# EAGLE design Transceiver (EAGLE 9.4.2)
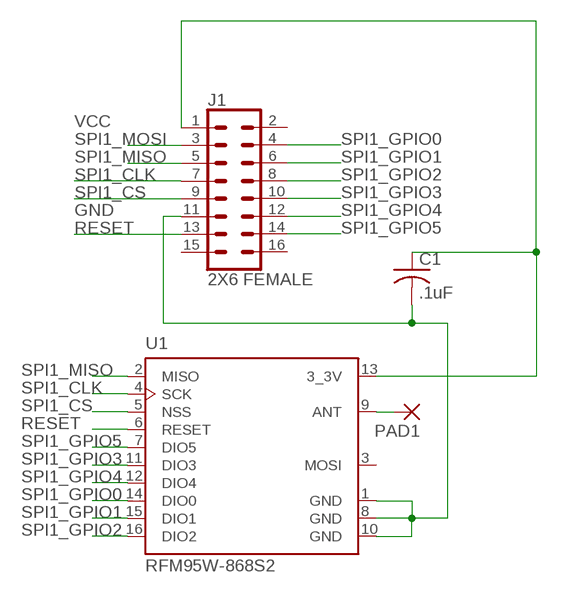
[diagram p0: schematic, sheet 1]

## Parts
C1  .1uF  C-ALL_PACKAGESC1206  [C1206]
J1  2X6 FEMALE  SENSOR_BREAKOUTPTH_FEMALE  [2X7]
PAD1  2,54/1,0  [2,54/1,0]
U1  RFM95W-868S2  [XCVR_RFM95W-868S2]

## Nets
GND: C1.2 J1.11 U1.1(GND) U1.8(GND) U1.10(GND)
N$12: PAD1.1(P) U1.9(ANT)
RESET: J1.13 U1.6(RESET)
SPI1_CLK: J1.7 U1.4(SCK)
SPI1_CS: J1.9 U1.5(NSS)
SPI1_GPIO0: J1.4 U1.14(DIO0)
SPI1_GPIO1: J1.6 U1.15(DIO1)
SPI1_GPIO2: J1.8 U1.16(DIO2)
SPI1_GPIO3: J1.10 U1.11(DIO3)
SPI1_GPIO4: J1.12 U1.12(DIO4)
SPI1_GPIO5: J1.14 U1.7(DIO5)
SPI1_MISO: J1.5 U1.2(MISO)
SPI1_MOSI: J1.3
VCC: C1.1 J1.1 U1.13(3_3V)
Unconnected: J1.2 J1.15 J1.16 U1.3(MOSI)

## Library data of the parts
C1 = RTR:C-ALL_PACKAGES: CAPACITOR, American symbol
J1 = RTR:SENSOR_BREAKOUT: .1 inch-spaced 12P sensor breakout Used as a generalized connector for attaching new sensors; PROD_ID: CONN-12423
PAD1 = wirepad:2,54/1,0: THROUGH-HOLE PAD
U1 = RFM95W-868S2:RFM95W-868S2: Mod Txrx Lora +20dbm 868mhz Smd; AVAILABILITY: Unavailable; MF: RF; MP: RFM95W-868S2; PACKAGE: SMD-16 Hope Microelectronics; PRICE: None

## Board
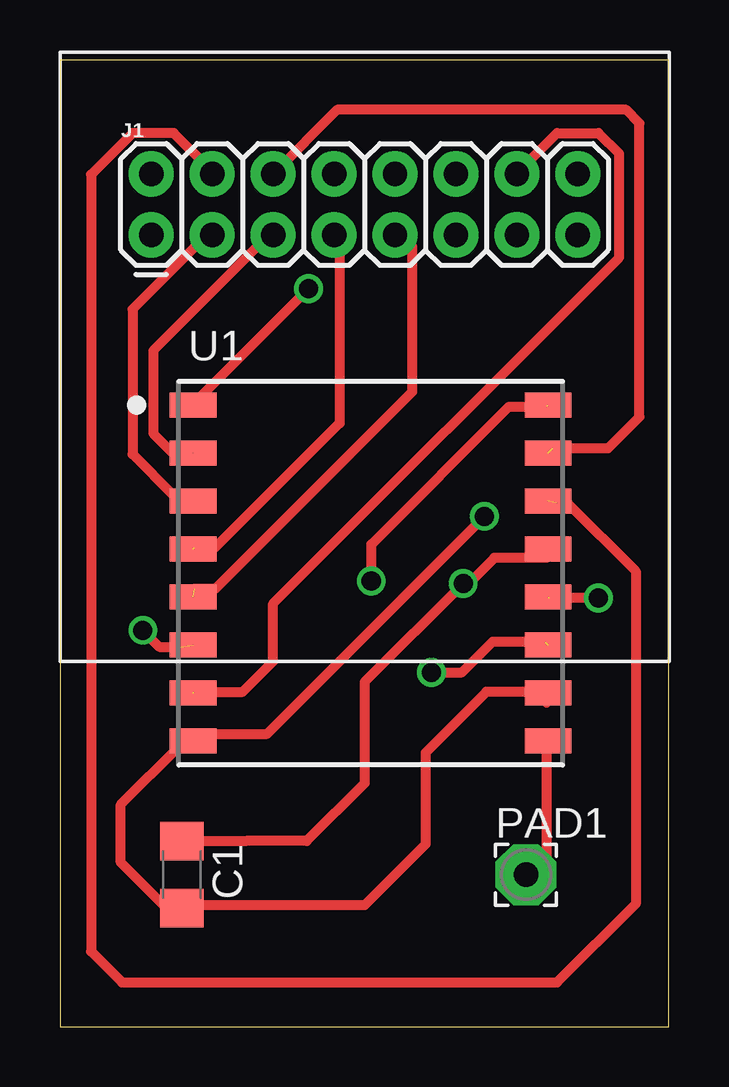
[diagram p1: board, top side]
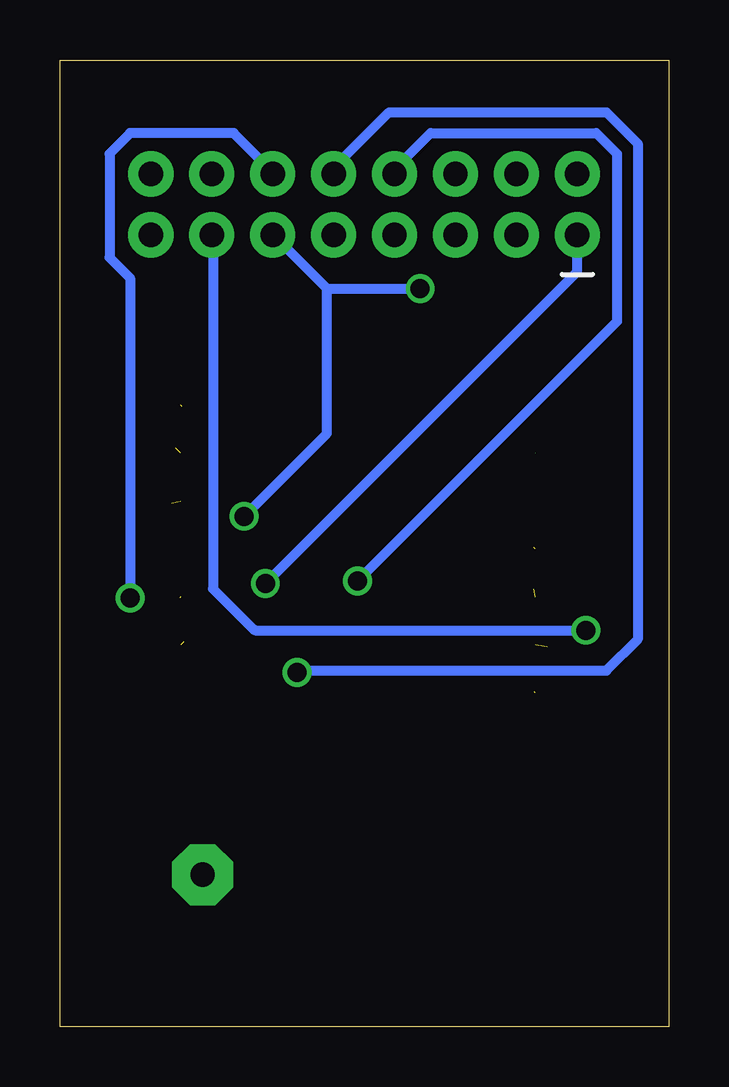
[diagram p2: board, bottom side, seen from below]

Size 25.38 x 40.31 mm. Coordinates in mm from the lower left corner, seen from the top.
Outline: 0,0 25.38,0 25.38,40.31 0,40.31 0,0
Copper layers (1*16): Top 0.035mm / dielectric 1.5mm / Bottom 0.035mm
Design rules "default *": minimum track width 16mil, minimum drill 31.25mil, track to track 16mil, track to pad 18mil, pad to pad 6mil, via to via 18mil, smd to smd 6mil, copper to edge 40mil, drill to drill 6mil, minimum pad ring 10mil, minimum via ring 8mil, stop-mask expansion 4mil, vias tented up to drill 0mil, thermal gap 10mil

### Footprints (pad centres in the part's own frame; a part is rotated, then mirrored left to right if it is on the bottom)
C1206 = smd 1.6 x 1.8: 1 -1.4,0; 2 1.4,0
2X7 = drill 1.016 pad 1.88: 1 -8.89,5.08; 2 -8.89,7.62; 3 -6.35,5.08; 4 -6.35,7.62; 5 -3.81,5.08; 6 -3.81,7.62; 7 -1.27,5.08; 8 -1.27,7.62; 9 1.27,5.08; 10 1.27,7.62; 11 3.81,5.08; 12 3.81,7.62; 13 6.35,5.08; 14 6.35,7.62; 15 8.89,5.08; 16 8.89,7.62
2,54/1,0 = drill 1.016 pad 2.54 octagon: 1 0,0
XCVR_RFM95W-868S2 = smd 1.95 x 1.05: 1 -7.4,7; 2 -7.4,5; 3 -7.4,3; 4 -7.4,1; 5 -7.4,-1; 6 -7.4,-3; 7 -7.4,-5; 8 -7.4,-7; 9 7.4,-7; 10 7.4,-5; 11 7.4,-3; 12 7.4,-1; 13 7.4,1; 14 7.4,3; 15 7.4,5; 16 7.4,7

### Placement (x,y rotation side)
C1  5.08,6.35 270 top
J1  12.7,27.94 0 top
PAD1  19.43,6.35 0 top
U1  12.95,18.92 0 top

### Tracks (layer width: path | path; a pad name or v marks a point on that pad's centre or on a via)
GND  (via drill 0.79)
  Top 0.406: v10.36,30.79 5.61,26.04 U1.1 | 4.72,5.28 C1.2 | 20.3,13.51 U1.10 20.31,13.97 17.78,13.97 15.24,11.43 15.24,7.62 12.7,5.08 5.36,5.08 5.16,5.28 C1.2 | v17.7,21.29 8.64,12.22 5.61,12.22 U1.8 4.98,11.71 2.54,9.27 2.54,6.86 4.45,4.95 C1.2
  Bottom 0.406: 14.25,30.79 v10.36,30.79 | 14.25,30.79 16.41,32.94 J1.11 | 14.25,30.79 14.25,24.74 v17.7,21.29
N$12
  Top 0.406: U1.9 20.3,11.79 20.3,7 PAD1.1
RESET  (via drill 0.79)  (1 unrouted)
  Top 0.406: 5.05,15.85 4.14,15.85 v3.45,16.54
  Bottom 0.406: v3.45,16.54 17.25,16.54 17.27,16.56 17.3,16.56 19,18.26 19,32.94 J1.13
SPI1_CLK  (1 unrouted)
  Top 0.406: 5.61,19.99 6.48,19.99 11.66,25.17 11.66,32.94 J1.7
SPI1_CS  (1 unrouted)
  Top 0.406: 5.61,18.26 6.48,18.26 14.68,26.47 14.68,32.51 14.25,32.94 J1.9
SPI1_GPIO0  (1 unrouted)
  Top 0.406: 20.73,21.84 21.16,21.84 24,19 24,5.13 20.73,1.85 2.59,1.85 1.29,3.15 1.29,35.54 3.02,37.26 4.75,37.26 6.04,35.97 J1.4
SPI1_GPIO1  (1 unrouted)
  Top 0.406: 20.56,24.13 22.86,24.13 24.16,25.43 24.16,37.67 23.61,38.23 11.56,38.23 J1.6
SPI1_GPIO2  (via drill 0.79)  (1 unrouted)
  Top 0.406: 20.3,25.86 18.72,25.86 12.98,20.12 v12.98,18.59
  Bottom 0.406: v12.98,18.59 2.16,29.41 2.16,36.4 3.02,37.26 9.93,37.26 11.23,35.97 J1.8
SPI1_GPIO3  (via drill 0.79)  (1 unrouted)
  Top 0.406: 20.22,16.05 18.03,16.05 16.76,14.78 v15.49,14.78
  Bottom 0.406: v15.49,14.78 15.42,14.86 2.59,14.86 1.29,16.15 1.29,36.83 2.59,38.12 11.66,38.12 13.82,35.97 J1.10
SPI1_GPIO4  (via drill 0.79)  (1 unrouted)
  Top 0.406: v22.45,17.88 20.39,17.88
  Bottom 0.406: v22.45,17.88 22.45,31.22 23.32,32.08 23.32,36.4 22.45,37.26 18.14,37.26 16.84,35.97 J1.12
SPI1_GPIO5  (1 unrouted)
  Top 0.406: J1.14 19.43,35.97 20.73,37.26 22.45,37.26 23.32,36.4 23.32,32.08 8.89,17.65 8.89,15.24 7.62,13.97 5.6,13.97
SPI1_MISO  (1 unrouted)
  Top 0.406: U1.2 4.7,23.93 3.89,24.74 3.89,28.19 8.64,32.94 J1.5
SPI1_MOSI
  Top 0.406: 5.18,22.15 4.75,22.15 3.02,23.88 3.02,29.92 6.04,32.94 J1.3
VCC  (via drill 0.79)
  Top 0.406: 5.16,7.87 C1.1 7.62,7.75 7.75,7.75 10.29,7.75 12.7,10.16 12.7,14.38 v16.82,18.49 16.82,18.26 18.11,19.56 20.3,19.56 U1.13
  Bottom 0.406: v16.82,18.49 3.81,31.5 J1.1